# Altium schematic sheet CapSense.SchDoc: CapSense
size A3
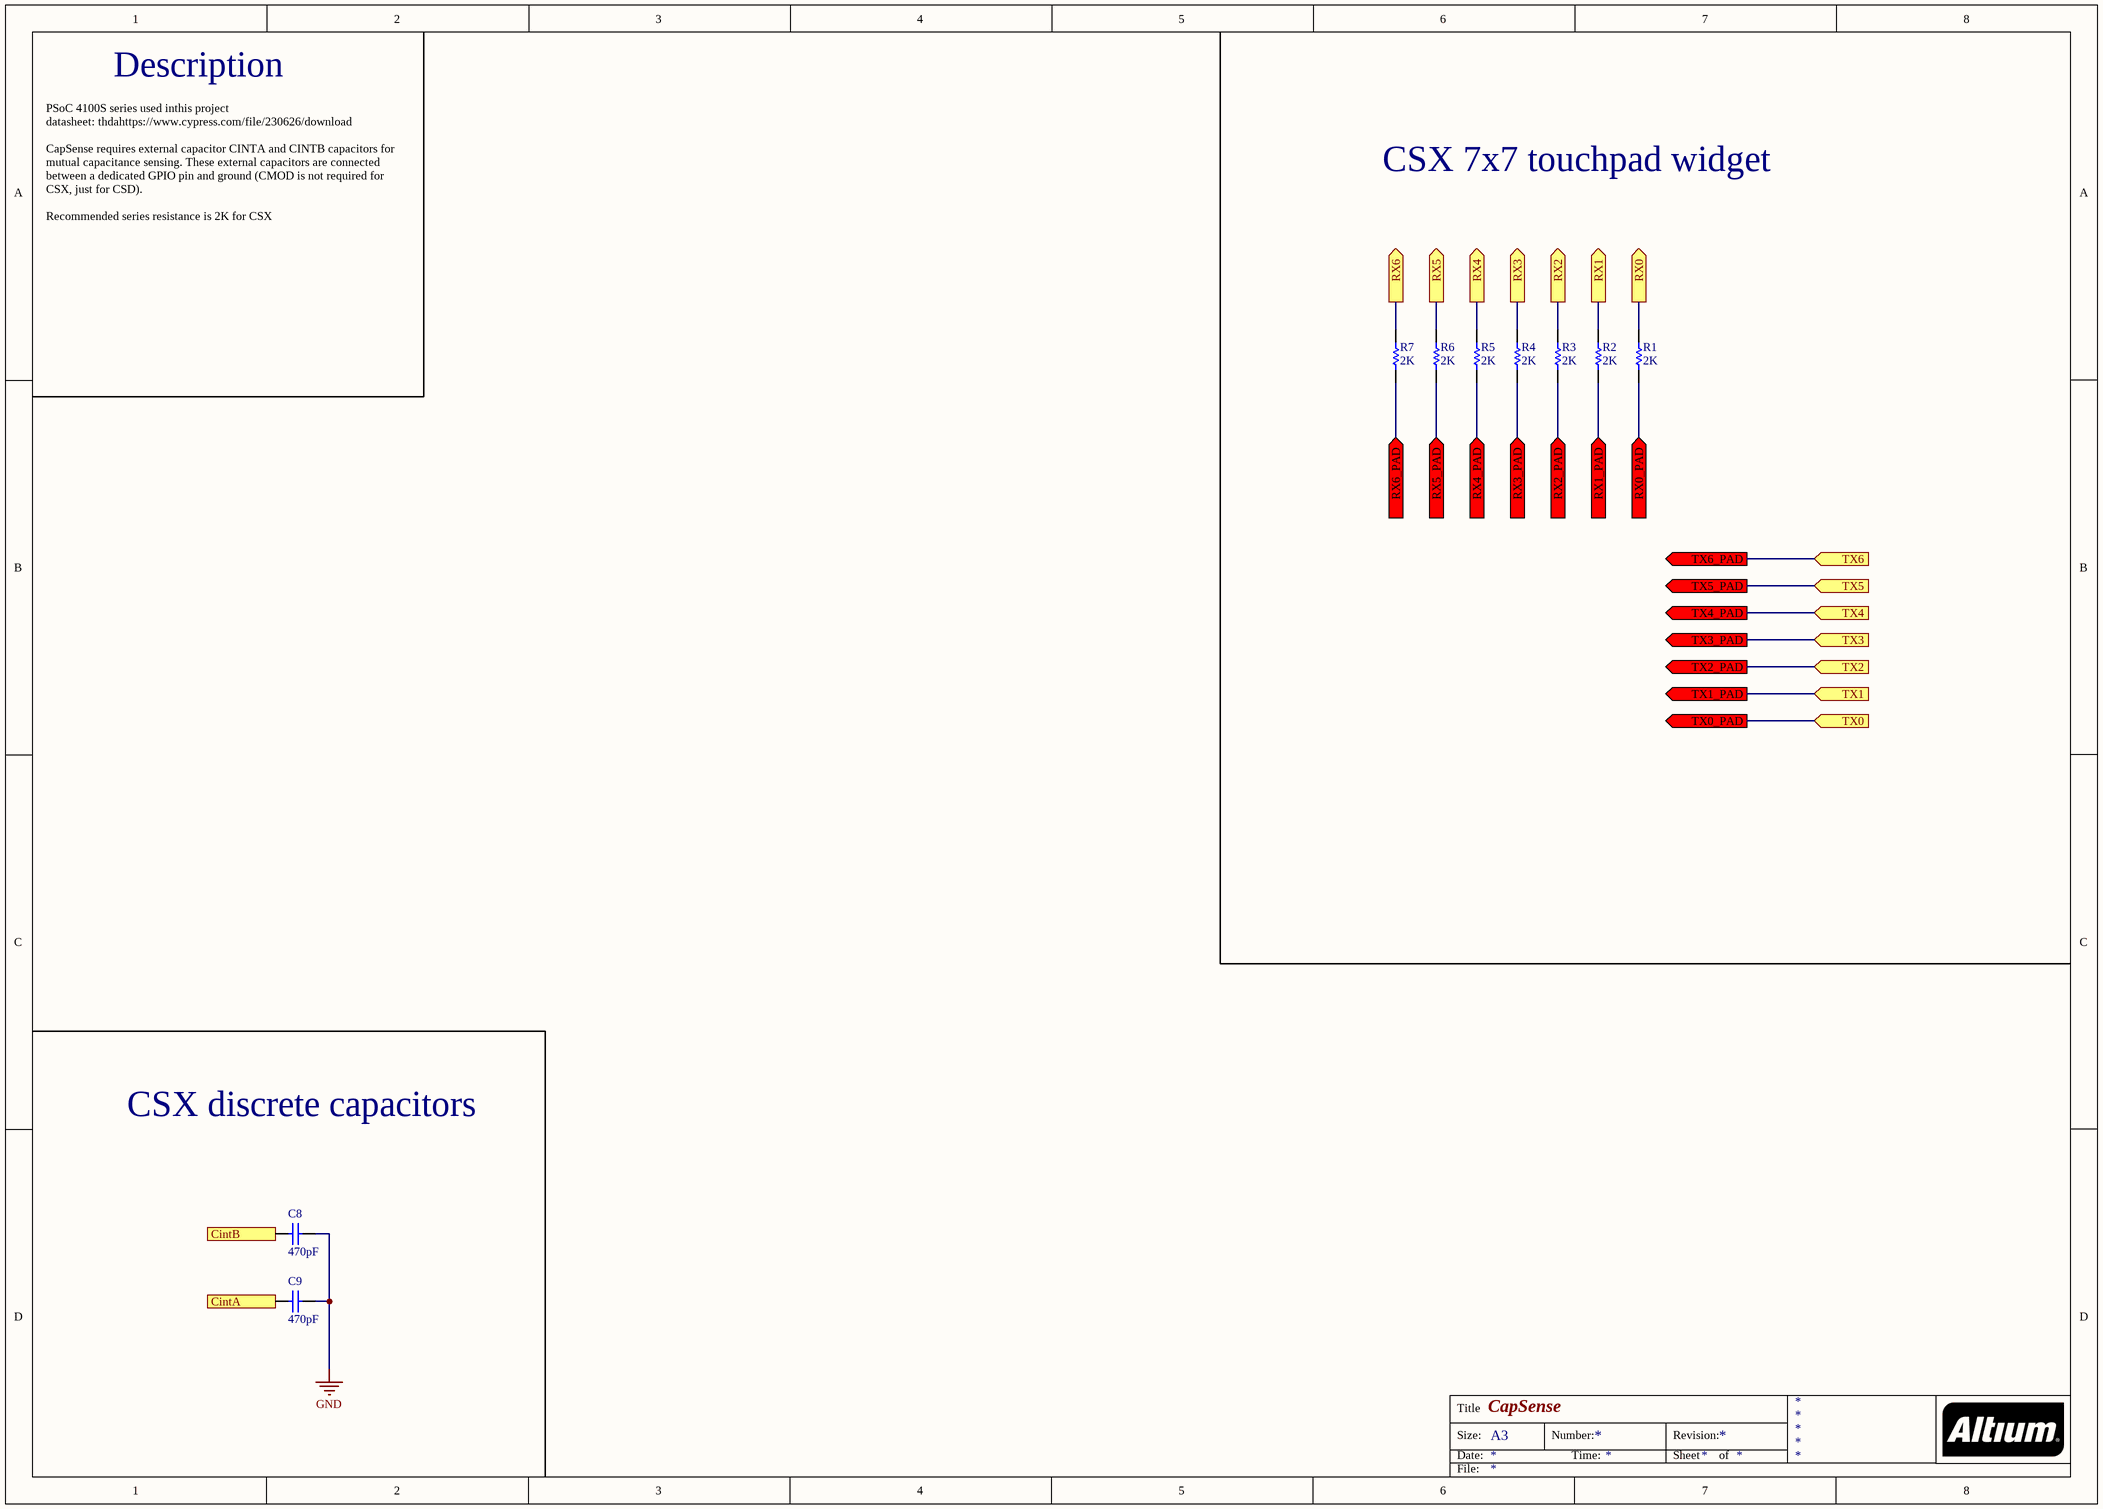
[diagram p0: CapSense.SchDoc]

## Parts
C8  470pF  [CAPC0603(1608)100_N]
C9  470pF  [CAPC0603(1608)100_N]
R1  2K  [RESC0603(1608)_N]
R2  2K  [RESC0603(1608)_N]
R3  2K  [RESC0603(1608)_N]
R4  2K  [RESC0603(1608)_N]
R5  2K  [RESC0603(1608)_N]
R6  2K  [RESC0603(1608)_N]
R7  2K  [RESC0603(1608)_N]

## Ports
CintA, CintB, RX0 (out), RX0_PAD (in), RX1 (out), RX1_PAD (in), RX2 (out), RX2_PAD (in), RX3 (out), RX3_PAD (in), RX4 (out), RX4_PAD (in), RX5 (out), RX5_PAD (in), RX6 (out), RX6_PAD (in), TX0 (in), TX0_PAD (out), TX1 (in), TX1_PAD (out), TX2 (in), TX2_PAD (out), TX3 (in), TX3_PAD (out), TX4 (in), TX4_PAD (out), TX5 (in), TX5_PAD (out), TX6 (in), TX6_PAD (out)

## Nets
GND: C8.2 C9.2
CintA: C9.1 ; port CintA
CintB: C8.1 ; port CintB
RX0: R1.1 ; port RX0
RX0_PAD: R1.2 ; port RX0_PAD
RX1: R2.1 ; port RX1
RX1_PAD: R2.2 ; port RX1_PAD
RX2: R3.1 ; port RX2
RX2_PAD: R3.2 ; port RX2_PAD
RX3: R4.1 ; port RX3
RX3_PAD: R4.2 ; port RX3_PAD
RX4: R5.1 ; port RX4
RX4_PAD: R5.2 ; port RX4_PAD
RX5: R6.1 ; port RX5
RX5_PAD: R6.2 ; port RX5_PAD
RX6: R7.1 ; port RX6
RX6_PAD: R7.2 ; port RX6_PAD
TX0: port TX0, port TX0_PAD
TX1: port TX1, port TX1_PAD
TX2: port TX2, port TX2_PAD
TX3: port TX3, port TX3_PAD
TX4: port TX4, port TX4_PAD
TX5: port TX5, port TX5_PAD
TX6: port TX6, port TX6_PAD

## Notes on the sheet
- Description
- CSX 7x7 touchpad widget
- PSoC 4100S series used inthis project
  datasheet: thdahttps://www.cypress.com/file/230626/download
  CapSense requires external capacitor CINTA and CINTB capacitors for mutual capacitance sensing. These external capacitors are connected between a dedicated GPIO pin and ground (CMOD is not required for CSX, just for CSD).
  Recommended series resistance is 2K for CSX
- CSX discrete capacitors
- Title
- Size:
- Date:
- A3
- Number:
- Time:
- Revision:
- Sheet
- of
- File:

## Library data of the parts
C8 C9 = CMP-1035-01661-1: CAP 470pF 10V ±10% 0603 (1608 Metric) Thickness 1mm SMD; Case-EIA: 0603; Tolerance: Â±10%; Case-Metric: 1608; Max Thickness: 1 mm; Rated Voltage: 10 V; Technology: SMT; Value: 470pF
R1-R7 = CMP-1012-00081-1: 2K 0.1W 5% 0603 (1608 Metric)  SMD; Case-Metric: 1608; Value: 2000.00 Ohm; Case-EIA: 0603; Tolerance: 5 %; Technology: SMT; Power: 0.1 W